# EAGLE design stylus (EAGLE 9.4.2)
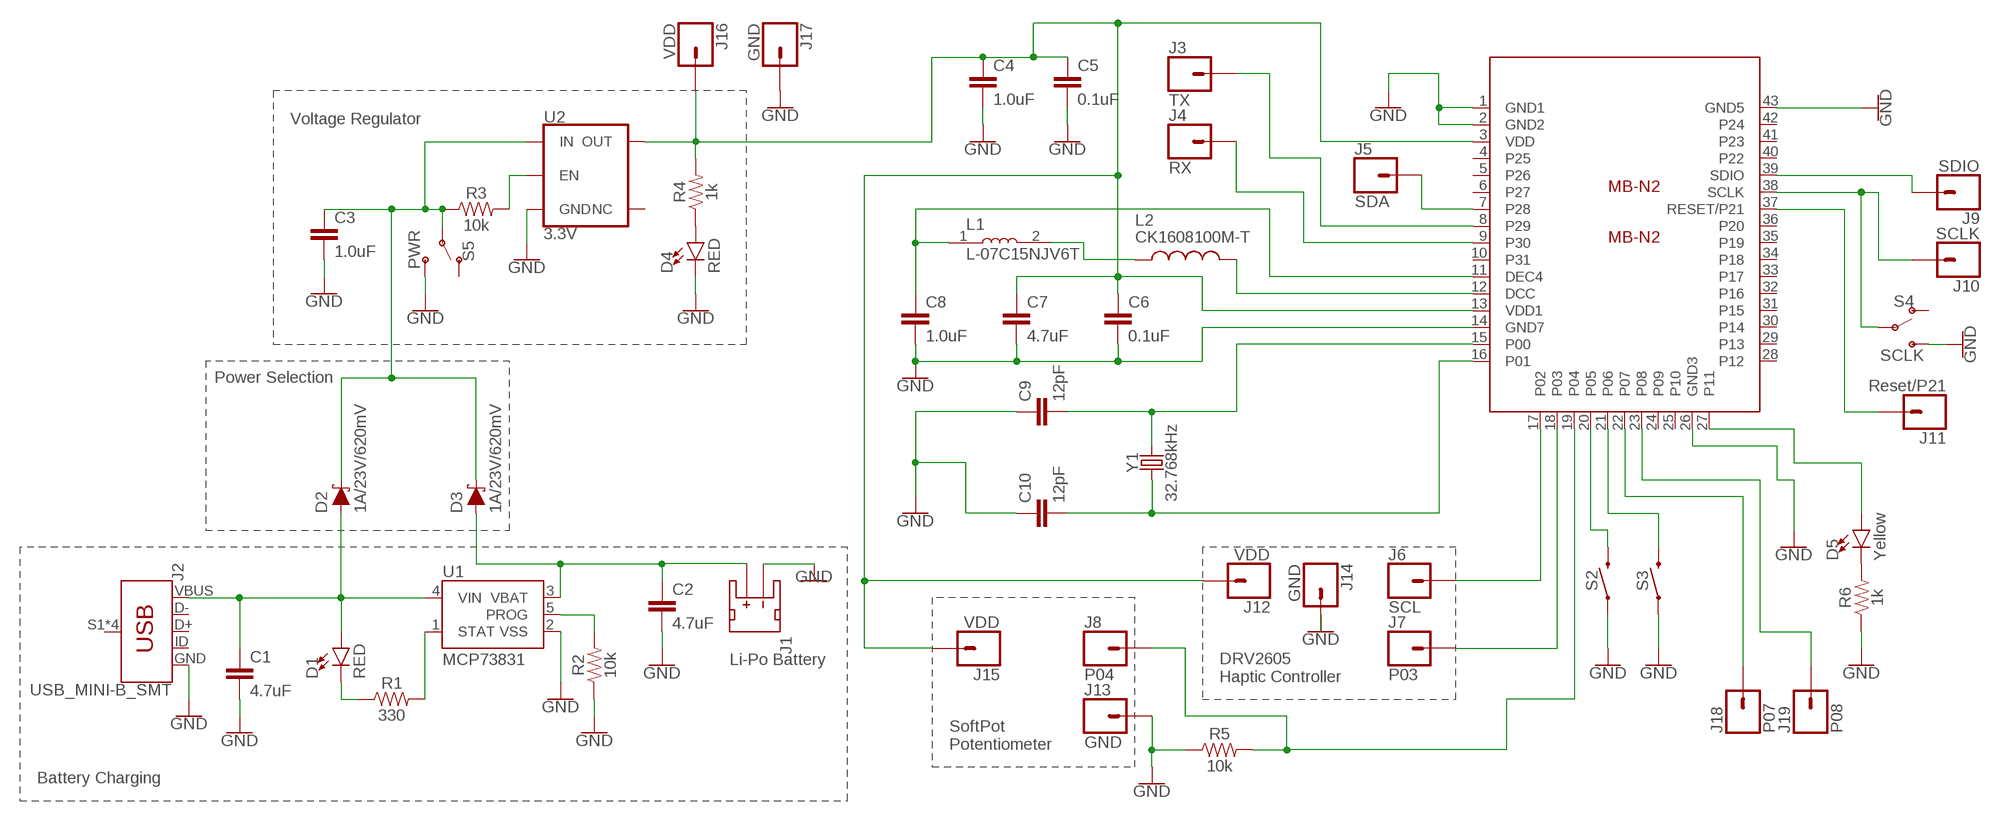
[diagram p0: schematic, sheet 1]

## Parts
C1  4.7uF  4.7UF0603  [0603]
C2  4.7uF  4.7UF0603  [0603]
C3  1.0uF  1.0UF-0603-16V-10%  [0603]
C4  1.0uF  1.0UF-0603-16V-10%  [0603]
C5  0.1uF  0.1UF-0603-25V-(+80/-20%)  [0603]
C6  0.1uF  0.1UF-0603-25V-(+80/-20%)  [0603]
C7  4.7uF  4.7UF0603  [0603]
C8  1.0uF  1.0UF-0603-16V-10%  [0603]
C9  12pF  12PF-0603-50V-5%  [0603]
C10  12pF  12PF-0603-50V-5%  [0603]
D1  RED  LED-RED1206  [LED-1206]
D2  1A/23V/620mV  DIODE-SCHOTTKY-BAT20J  [SOD-323]
D3  1A/23V/620mV  DIODE-SCHOTTKY-BAT20J  [SOD-323]
D4  RED  LED-RED0603  [LED-0603]
D5  Yellow  LED-YELLOWLILYPAD  [LED-1206]
J1  LIPO Bat  JST_2MM_MALE  [JST-2-SMD]
J2  USB_MINI-B_SMT  [USB-MINIB]
J3  TX  CONN_01  [1X01]
J4  RX  CONN_01  [1X01]
J5  SDA  CONN_01  [1X01]
J6  SCL  CONN_01  [1X01]
J7  P03  CONN_01  [1X01]
J8  P04  CONN_01  [1X01]
J9  SDIO  CONN_01  [1X01]
J10  SCLK  CONN_01  [1X01]
J11  Reset/P21  CONN_01  [1X01]
J12  VDD  CONN_01  [1X01]
J13  GND  CONN_01  [1X01]
J14  GND  CONN_01  [1X01]
J15  VDD  CONN_01  [1X01]
J16  VDD  CONN_01  [1X01]
J17  GND  CONN_01  [1X01]
J18  P07  CONN_01  [1X01]
J19  P08  CONN_01  [1X01]
L1  L-07C15NJV6T  [INDC1005X60N]
L2  CK1608100M-T  [INDC1608X95N]
MB-N2  MB-N2  [MB-N2]
R1  330  330OHM-0603-1/10W-1%  [0603]
R2  10k  10KOHM-0603-1/10W-1%  [0603]
R3  10k  10KOHM-0603-1/10W-1%  [0603]
R4  1k  1KOHM-0603-1/10W-1%  [0603]
R5  10k  10KOHM-0603-1/10W-1%  [0603]
R6  1k  1KOHM-0603-1/10W-1%  [0603]
S2  MOMENTARY-SWITCH-SPST-SMD-4.5MM  [TACTILE_SWITCH_SMD_4.5MM]
S3  MOMENTARY-SWITCH-SPST-SMD-4.5MM  [TACTILE_SWITCH_SMD_4.5MM]
S4  SCLK  SWITCH-SPDT-SMD-AYZ0202  [SWITCH_DPDT_SMD_AYZ0202]
S5  PWR  SWITCH-SPDT-SMD-RIGHT-ANGLE  [SWITCH_SPST_SMD_A]
U1  MCP73831  [SOT23-5]
U2  3.3V  V_REG_AP2112K-3.3V  [SOT23-5]
Y1  32.768kHz  CRYSTAL-32.768KHZSMD-3.2X1.5  [CRYSTAL-SMD-3.2X1.5MM]

## Nets
DCC: L2.2 MB-N2.12(DCC)
DEC4: C8.1 L1.1 MB-N2.11(DEC4)
EN: R3.2 U2.3(EN)
GND: C1.2 C2.2 C3.2 C4.2 C5.2 C6.2 C7.2 C8.2 C9.1 C10.1 D4.C J1.1(-) J2.GND J13.1 J14.1 J17.1 MB-N2.1(GND1) MB-N2.2(GND2) MB-N2.14(GND7) MB-N2.26(GND3) MB-N2.43(GND5) R2.1 R5.1 R6.1 S2.2 S2.3 S3.2 S3.3 S4.3(S) S5.3(S) U1.2(VSS) U2.2(GND)
N$2: D1.C R1.1
N$9: D4.A R4.1
N$10: L1.2 L2.1
N$13: C9.2 MB-N2.15(P00) Y1.P$2
N$15: C10.2 MB-N2.16(P01) Y1.P$1
N$20: J11.1 MB-N2.37(RESET/P21)
N$25: D5.A MB-N2.27(P11)
N$27: D5.C R6.2
P03: J7.1 MB-N2.18(P03)
P04: J8.1 MB-N2.19(P04) R5.2
P05: MB-N2.20(P05) S2.1 S2.4
P06: MB-N2.21(P06) S3.1 S3.4
P07: J18.1 MB-N2.22(P07)
P08: J19.1 MB-N2.23(P08)
PROG: R2.2 U1.5(PROG)
RX: J4.1 MB-N2.9(P30)
SCL: J6.1 MB-N2.17(P02)
SCLK: J10.1 MB-N2.38(SCLK) S4.2(P)
SDA: J5.1 MB-N2.7(P28)
SDIO: J9.1 MB-N2.39(SDIO)
STAT: R1.2 U1.1(STAT)
TX: J3.1 MB-N2.8(P29)
VBAT: C2.1 D3.A J1.2(+) U1.3(VBAT)
VDD: C4.1 C5.1 C6.1 C7.1 J12.1 J15.1 J16.1 MB-N2.3(VDD) MB-N2.13(VDD1) R4.2 U2.5(OUT)
VIN: C1.1 D1.A D2.A J2.VBUS U1.4(VIN)
VR-IN: C3.1 D2.C D3.C R3.1 S5.2(P) U2.1(IN)
Unconnected: J1.NC1(PAD1) J1.NC2(PAD2) J2.D+ J2.D- J2.ID J2.S1(SHIELD) J2.S2(SHIELD) J2.S3(SHIELD) J2.S4(SHIELD) MB-N2.4(P25) MB-N2.5(P26) MB-N2.6(P27) MB-N2.10(P31) MB-N2.24(P09) MB-N2.25(P10) MB-N2.28(P12) MB-N2.29(P13) MB-N2.30(P14) MB-N2.31(P15) MB-N2.32(P16) MB-N2.33(P17) MB-N2.34(P18) MB-N2.35(P19) MB-N2.36(P20) MB-N2.40(P22) MB-N2.41(P23) MB-N2.42(P24) S4.1(O) S5.1(O) U2.4(NC)

## Notes on the sheet
- Voltage Regulator
- Power Selection
- Li-Po Battery
- DRV2605
  Haptic Controller
- SoftPot
  Potentiometer
- Battery Charging

## Library data of the parts
C1 C2 C7 = SparkFun-Capacitors:4.7UF: 4.7µF ceramic capacitors A capacitor is a passive two-terminal electrical component used to store electrical energy temporarily in an electric field.; PROD_ID: CAP-08280
C3 C4 C8 = SparkFun-Capacitors:1.0UF: 1µF ceramic capacitors A capacitor is a passive two-terminal electrical component used to store electrical energy temporarily in an electric field.; PROD_ID: CAP-00868
C5 C6 = SparkFun-Capacitors:0.1UF: 0.1µF ceramic capacitors A capacitor is a passive two-terminal electrical component used to store electrical energy temporarily in an electric field.; PROD_ID: CAP-00810
C9 C10 = SparkFun-Capacitors:12PF: 12pF ceramic capacitors A capacitor is a passive two-terminal electrical component used to store electrical energy temporarily in an electric field.; PROD_ID: CAP-09137
D1 = SparkFun-LED:LED-RED: Red SMD LED Used in manufacturing of most products at SparkFun Packages: 0603 - SMD 0603 package [Product Link] <http://docs.avagotech.com/docs/AV02-0551EN> 0603 SMART - SMD 0603 SMART package ( more efficient and expensive)[Product Link] <http://www.osram-os.com/Graphics/XPic2/00077099_0.pdf> 1206 - SMD1206 package [Product Link] <https://www.sparkfun.com/datasheets/DevTools/LilyPad/Q150OVS4.pdff> SparkFun Products: Pro Mini 328 -5V <https://www.sparkfun.com/products/821> RedBoard <https://www.sparkfun.com/products/12757> IOIO-OTG <https://www.sparkfun.com/products/13613>; PROD_ID: DIO-09912
D2 D3 = SparkFun-DiscreteSemi:DIODE-SCHOTTKY: Schottky diode A Schottky diode is a semiconductor diode which has a low forward voltage drop and a very fast switching action.; PROD_ID: DIO-11623
D4 = SparkFun-LED:LED-RED: Red SMD LED Used in manufacturing of most products at SparkFun Packages: 0603 - SMD 0603 package [Product Link] <http://docs.avagotech.com/docs/AV02-0551EN> 0603 SMART - SMD 0603 SMART package ( more efficient and expensive)[Product Link] <http://www.osram-os.com/Graphics/XPic2/00077099_0.pdf> 1206 - SMD1206 package [Product Link] <https://www.sparkfun.com/datasheets/DevTools/LilyPad/Q150OVS4.pdff> SparkFun Products: Pro Mini 328 -5V <https://www.sparkfun.com/products/821> RedBoard <https://www.sparkfun.com/products/12757> IOIO-OTG <https://www.sparkfun.com/products/13613>; PROD_ID: DIO-00819
D5 = SparkFun-LED:LED-YELLOW: Yellow SMD LED Used in manufacturing several products at SparkFun. Packages: 0603 - SMD 0603 package[Product Link] <http://www.kingbrightusa.com/product.asp?catalog_name=LED&product_id=APT1608SYCK> 0603 -SMART - SMART SMD 0603 package (more efficient/more expensive) [Product Link] <http://www.osram-os.com/osram_os/en/products/product-catalog/led-light-emitting-diodes/smartled-0603/ly-l29k/index.jsp> LilyPad - SMD1206 package[Product Datasheet] <https://www.sparkfun.com/datasheets/DevTools/LilyPad/Q150YUS4.pdf> SparkFun Products: Blynk Board <https://www.sparkfun.com/products/13794> IOIO-OTG <https://www.sparkfun.com/products/13613> XBee Explorer Serial <https://www.sparkfun.com/products/13225>; PROD_ID: DIO-09909
J1 = SparkFun-Connectors:JST_2MM_MALE: JST 2MM MALE RA CONNECTOR Two pin, compact surface mount connector. Commonly used as a battery input connection point. We really like the solid locking feeling and high current rating on these small connectors. We use these all the time as battery connectors. Mates to single-cell LiPo batteries. Here is the connector we sell at SparkFun: JST Right Angle Connector - White <https://www.sparkfun.com/products/8612> (PRT-08612) Datasheet <http://www.sparkfun.com/datasheets/Prototyping/Connectors/JST-Horizontal.pdf> It was used on these SparkFun products: SparkFun MOSFET Power Controller <https://www.sparkfun.com/products/11214> (PRT-11214) SparkFun Battery Babysitter - LiPo Battery Manager <https://www.sparkfun.com/products/13777> (PRT-13777) And many, many others that required a lipo battery connection.; PROD_ID: CONN-11443; SF_ID: PRT-08612
J2 = SparkFun-Connectors:USB_MINI-B: USB type Mini-B Connector Breaks out 5th pin, and includes shield pins if needed. SparkFun Products: SparkFun FTDI Basic Breakout <https://www.sparkfun.com/products/9716> SparkFun XBee Explorer USB <https://www.sparkfun.com/products/11812> SparkFun Redboard <https://www.sparkfun.com/products/12757>; PROD_ID: CONN-08193; SF_ID: PRT-00587
J3-J19 = SparkFun-Connectors:CONN_01: Single connection point. Often used as Generic Header-pin footprint for 0.1 inch spaced/style header connections On any of the 0.1 inch spaced packages, you can populate with these: Break Away Headers - Straight <https://www.sparkfun.com/products/116> (PRT-00116) Break Away Male Headers - Right Angle <https://www.sparkfun.com/products/553> (PRT-00553) Female Headers <https://www.sparkfun.com/products/115> (PRT-00115) Break Away Headers - Machine Pin <https://www.sparkfun.com/products/117> (PRT-00117) Break Away Female Headers - Swiss Machine Pin <https://www.sparkfun.com/products/743> (PRT-00743) This device is also useful as a general connection point to wire up your design to another part of your project. Our various solder wires solder well into these plated through hole pads. Hook-Up Wire - Assortment (Stranded, 22 AWG) <https://www.sparkfun.com/products/11375> (PRT-11375) Hook-Up Wire - Assortment (Solid Core, 22 AWG) <https://www.sparkfun.com/products/11367> (PRT-11367) View the entire wire category on our website here <https://www.sparkfun.com/categories/141> Special notes: SMTSO-256-ET is a "flush mount" nut for a 4-40 screw. We mostly use this on specialty testbeds; it is a nice way to connect hardware to your PCB at an adjustable hieght. Also note, the SNAP packages are for using a snappable style connector. We sell a baggie of snaps and they are also used on two LilyPad designs: Snap Assortment - 30 pack (male and female) <https://www.sparkfun.com/products/11347> (DEV-11347) LilyPad Arduino SimpleSnap <https://www.sparkfun.com/products/10941> (DEV-10941) LilyPad SimpleSnap Protoboard <https://www.sparkfun.com/products/10940> (DEV-10940)
L1 = L-07C15NJV6T:L-07C15NJV6T: Inductor RF Chip Multi-Layer 15nH 5% 100MHz 8Q-Factor Ceramic 250mA 600mOhm DCR 0402 T/R; DESCRIPTION: Inductor RF Chip Multi-Layer 15nH 5% 100MHz 8Q-Factor Ceramic 250mA 600mOhm DCR 0402 T/R; DIGI-KEY_PART_NUMBER: 712-1408-1-ND; DIGI-KEY_PURCHASE_URL: https://www.digikey.com/product-detail/en/johanson-technology-inc/L-07C15NJV6T/712-1408-1-ND/1840086?utm_source=snapeda&utm_medium=aggregator&utm_campaign=symbol; MF: Johanson Technology; MP: L-07C15NJV6T; PACKAGE: 0402 Johanson
L2 = CK1608100M-T:CK1608100M-T: INDUCTOR, 10UH, 50mA, 20%, 17MHZ, SMD; DESCRIPTION: Inductor Chip Shielded Multi-Layer 10uH 20% 2MHz 20Q-Factor Ferrite 50mA 1.105Ohm DCR 0603 T/R; DIGI-KEY_PART_NUMBER: 587-1684-1-ND; DIGI-KEY_PURCHASE_URL: https://www.digikey.com/product-detail/en/taiyo-yuden/CK1608100M-T/587-1684-1-ND/1007998?utm_source=snapeda&utm_medium=aggregator&utm_campaign=symbol; MF: Taiyo Yuden; MP: CK1608100M-T; PACKAGE: 1608 Taiyo Yuden
MB-N2 = MB-N2:MB-N2
R1 = SparkFun-Resistors:330OHM: 330Ω resistor A resistor is a passive two-terminal electrical component that implements electrical resistance as a circuit element. Resistors act to reduce current flow, and, at the same time, act to lower voltage levels within circuits. - Wikipedia; PROD_ID: RES-00818
R2 R3 R5 = SparkFun-Resistors:10KOHM: 10kΩ resistor A resistor is a passive two-terminal electrical component that implements electrical resistance as a circuit element. Resistors act to reduce current flow, and, at the same time, act to lower voltage levels within circuits. - Wikipedia; PROD_ID: RES-00824
R4 R6 = SparkFun-Resistors:1KOHM: 1kΩ resistor A resistor is a passive two-terminal electrical component that implements electrical resistance as a circuit element. Resistors act to reduce current flow, and, at the same time, act to lower voltage levels within circuits. - Wikipedia; PROD_ID: RES-07856
S2 S3 = SparkFun-Switches:MOMENTARY-SWITCH-SPST: Momentary Switch (Pushbutton) - SPST Normally-open (NO) SPST momentary switches (buttons, pushbuttons). Variants PTH-12MM - 12mm square, through-hole Momentary Pushbutton Switch - 12mm Square <https://www.sparkfun.com/products/9190> (COM-09190) PTH-6.0MM, PTH-6.0MM-KIT - 6.0mm square, through-hole Mini Pushbutton Switch <https://www.sparkfun.com/products/97> (COM-00097) KIT package intended for soldering kit's - only one side of pads' copper is exposed. PTH-RIGHT-ANGLE-KIT - Right-angle, through-hole Right Angle Tactile Button <https://www.sparkfun.com/products/10791> - Used on SparkFun BigTime Watch Kit <https://www.sparkfun.com/products/11734> SMD-12MM - 12mm square, surface-mount Tactile Button - SMD (12mm) <https://www.sparkfun.com/products/12993> (COM-12993) Used on SparkFun PicoBoard <https://www.sparkfun.com/products/11888> SMD-4.5MM - 4.5mm Square Trackball Switch Used on SparkFun Blackberry Trackballer Breakout <https://www.sparkfun.com/products/13169> SMD-4.6MMX2.8MM - 4.60mm x 2.80mm, surface mount Used on SparkFun SAMD21 Mini Breakout <https://www.sparkfun.com/products/13664> SMD-5.2MM, SMD-5.2-REDUNDANT - 5.2mm square, surface-mount Mini Pushbutton Switch - SMD <https://www.sparkfun.com/products/8720> (COM-08720) Used on Arduino Pro Mini <https://www.sparkfun.com/products/11114> REDUNDANT package connects both switch circuits together SMD-6.0X3.5MM - 6.0 x 3.5mm, surface mount Momentary Reset Switch SMD <https://www.sparkfun.com/products/8229> (COM-08229) SMD-6.2MM-TALL - 6.2mm square, surface mount Tactile Button - SMD (6mm) <https://www.sparkfun.com/products/12992> Used on SparkFun Digital Sandbox <https://www.sparkfun.com/products/12651> SMD-RIGHT-ANGLE - Right-angle, surface mount Used on SparkFun Block for Intel® Edison - Arduino <https://www.sparkfun.com/products/13036>; PROD_ID: SWCH-09213
S4 = SparkFun-Switches:SWITCH-SPDT: Single Pole, Double Throw (SPDT) Switch Single-pole, double-throw (SPDT) switch. Variant Overview SMD-AYZ0202 Surface Mount DPDT Switch <https://www.sparkfun.com/products/597> (COM-00597) Used on e.g. LilyPad Arduino USB - ATmega32U4 Board <https://www.sparkfun.com/products/12049> PTH-11.6X4.0MM SPDT Mini Power Switch <https://www.sparkfun.com/products/102> (COM-00102) Used on e.g. SparkFun Simon Says - Through-Hole Soldering Kit <https://www.sparkfun.com/products/10547> (KIT-10547) PTH-11.6X4.0MM-KIT KIT version of SPDT Mini Power Switch - Simplifies soldering by removing tStop of switch pins - only one side can be soldered. PTH-11.6X4.0MM-LOCK LOCK version of SPDT Mini Power Switch - Offset pins hold switch in place for easier soldering. SMD-RIGHT-ANGLE Surface Mount Right Angle Switch <https://www.sparkfun.com/products/10860> (COM-10860) Used on e.g. SparkFun ESP8266 Thing <https://www.sparkfun.com/products/13231>; PROD_ID: SWCH-08179; SF_ID: COM-00597
S5 = SparkFun-Switches:SWITCH-SPDT: Single Pole, Double Throw (SPDT) Switch Single-pole, double-throw (SPDT) switch. Variant Overview SMD-AYZ0202 Surface Mount DPDT Switch <https://www.sparkfun.com/products/597> (COM-00597) Used on e.g. LilyPad Arduino USB - ATmega32U4 Board <https://www.sparkfun.com/products/12049> PTH-11.6X4.0MM SPDT Mini Power Switch <https://www.sparkfun.com/products/102> (COM-00102) Used on e.g. SparkFun Simon Says - Through-Hole Soldering Kit <https://www.sparkfun.com/products/10547> (KIT-10547) PTH-11.6X4.0MM-KIT KIT version of SPDT Mini Power Switch - Simplifies soldering by removing tStop of switch pins - only one side can be soldered. PTH-11.6X4.0MM-LOCK LOCK version of SPDT Mini Power Switch - Offset pins hold switch in place for easier soldering. SMD-RIGHT-ANGLE Surface Mount Right Angle Switch <https://www.sparkfun.com/products/10860> (COM-10860) Used on e.g. SparkFun ESP8266 Thing <https://www.sparkfun.com/products/13231>; PROD_ID: SWCH-10651; SF_SKU: COM-10860
U1 = SparkFun-IC-Power:MCP73831: MCP73831T Li-Ion, Li-Pol Controller Miniature single cell, fully integrated Li-Ion, Li-polymer charge management controller Datasheet <http://ww1.microchip.com/downloads/en/DeviceDoc/20001984g.pdf> SparkFun Products: SparkFun ESP32 Thing <https://www.sparkfun.com/products/13907> SparkFun 9DoF Razor IMU M0 <https://www.sparkfun.com/products/14001>; PROD_ID: IC-09995
U2 = SparkFun-IC-Power:V_REG_AP2112: AP2112 - 600mA CMOS LDO Regulator w/ Enable The AP2112 is CMOS process low dropout linear regulator with enable function, the regulator delivers a guaranteed 600mA (min.) continuous load current. Features Output Voltage Accuracy: ±1.5% Output Current: 600mA (Min.) Foldback Short Current Protection: 50mA Enable Function to Turn ON/OFF VOUT Low Dropout Voltage (3.3V): 250mV (Typ.) @IOUT=600mA Excellent Load Regulation: 0.2%/A (Typ.) Excellent Line Regulation: 0.02%/V (Typ.) Low Quiescent Current: 55μA (Typ.) Low Standby Current: 0.01μA (Typ.) Low Output Noise: 50μVRMS PSRR: 100Hz -65dB, 1kHz -65dB OTSD Protection Stable with 1.0μF Flexible Cap: Ceramic, Tantalum and Aluminum Electrolytic Operation Temperature Range: -40°C to 85°C ESD: MM 400V, HBM 4000V; PROD_ID: VREG-12457
Y1 = SparkFun-Clocks:CRYSTAL-32.768KHZ: 32.768kHz Crystal Frequency: 32.768kHz Frequency Stability: ±20ppm Load Capacitance: 12.5pF (PTH-2X6 & SMD-3.2X1.5), 6pF (SMD-2X6) SparkFun Products: SparkFun BigTime Watch Kit <https://www.sparkfun.com/products/11734> SparkFun nRF52832 Breakout <https://www.sparkfun.com/products/13990> SparkFun Real Time Clock Module <https://www.sparkfun.com/products/12708>; PROD_ID: XTAL-13062

## Board
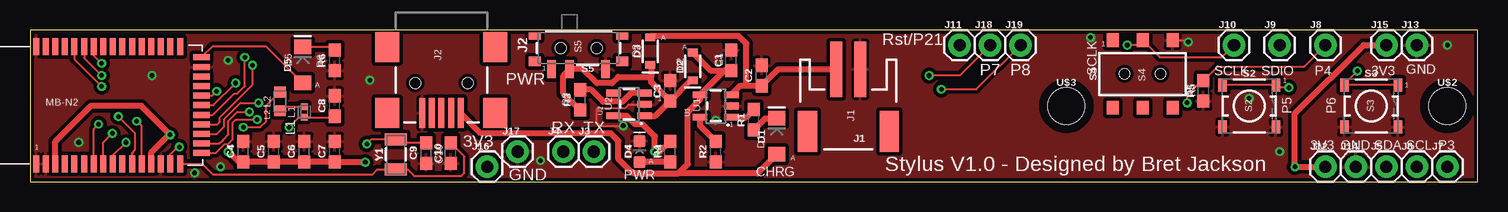
[diagram p1: board, top side]
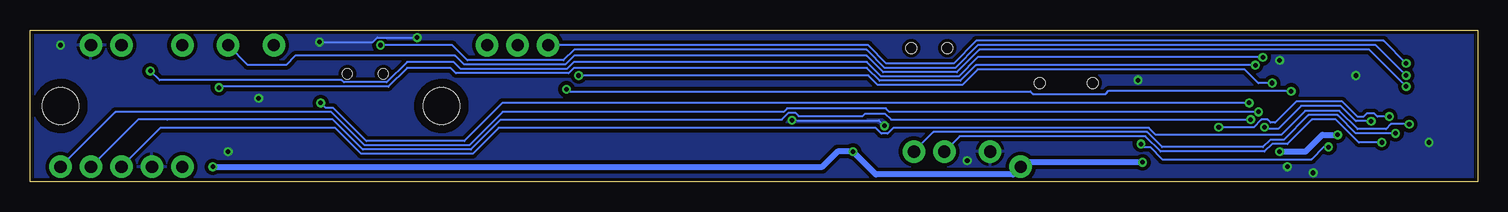
[diagram p2: board, bottom side, seen from below]

Size 120.65 x 12.7 mm. Coordinates in mm from the lower left corner, seen from the top.
Outline: 0,0 120.63,0 120.65,12.7 0,12.7 0,0
Copper layers (1*16): Top 0.035mm / dielectric 1.5mm / Bottom 0.035mm
Design rules "SparkFun-2-layer-TIGHT": minimum track width 7mil, minimum drill 15mil, track to track 7mil, track to pad 7mil, pad to pad 7mil, via to via 7mil, smd to smd 7mil, copper to edge 7mil, drill to drill 7mil, minimum pad ring 7mil, minimum via ring 7mil, stop-mask expansion 4mil, vias tented up to drill 25mil, thermal gap 10mil

### Footprints (pad centres in the part's own frame; a part is rotated, then mirrored left to right if it is on the bottom)
0603 = smd 1.1 x 1: 1 -0.85,0; 2 0.85,0
LED-1206 = smd 1.2 x 1.4: A -1.5,0; C 1.5,0
SOD-323 = smd 0.63 x 0.83: A 1.15,0; C -1.15,0
LED-0603 = smd 1 x 1: A -0.877,0; C 0.877,0
JST-2-SMD = smd 1 x 4.6: 1 -1,-3.7; 2 1,-3.7 | smd 1.6 x 3.4: NC1 -3.4,1.5; NC2 3.4,1.5
USB-MINIB = smd 2.5 x 0.5: D+ 2.5,0; D- 2.5,0.8; GND 2.5,-1.6; ID 2.5,-0.8; VBUS 2.5,1.6 | smd 2.5 x 2: S1 -3,4.5; S2 2.5,4.5; S3 -3,-4.5; S4 2.5,-4.5 | hole 0.9: 0,2.2; 0,-2.2
1X01 = drill 1.016 pad 1.88: 1 0,0
INDC1005X60N = smd 0.54 x 0.63: 1 -0.445,0; 2 0.445,0
INDC1608X95N = smd 0.9 x 0.97: 1 -0.785,0; 2 0.785,0
MB-N2 = smd 1.4 x 0.5: 1 -0.649,13.085; 2 -0.649,12.285; 3 -0.649,11.485; 4 -0.649,10.685; 5 -0.649,9.885; 6 -0.649,9.085; 7 -0.649,8.285; 8 -0.649,7.485; 9 -0.649,6.685; 10 -0.649,5.885; 11 -0.649,5.085; 12 -0.649,4.285; 13 -0.649,3.485; 14 -0.649,2.685; 15 -0.649,1.885; 16 -0.649,1.085; 28 9.151,1.085; 29 9.151,1.885; 30 9.151,2.685; 31 9.151,3.485; 32 9.151,4.285; 33 9.151,5.085; 34 9.151,5.885; 35 9.151,6.685; 36 9.151,7.485; 37 9.151,8.285; 38 9.151,9.085; 39 9.151,9.885; 40 9.151,10.685; 41 9.151,11.485; 42 9.151,12.285; 43 9.151,13.085 | smd 0.5 x 1.4: 17 0.251,-0.7; 18 1.051,-0.7; 19 1.851,-0.7; 20 2.651,-0.7; 21 3.451,-0.7; 22 4.251,-0.7; 23 5.051,-0.7; 24 5.851,-0.7; 25 6.651,-0.7; 26 7.451,-0.7; 27 8.251,-0.7
TACTILE_SWITCH_SMD_4.5MM = smd 0.7 x 1.1: 1 2.225,1.75; 2 2.225,-1.75; 3 -2.225,-1.75; 4 -2.225,1.75
SWITCH_DPDT_SMD_AYZ0202 = smd 1 x 1.15: 1 -2.5,2.825; 2 0,2.825; 3 2.5,2.825; 4 -2.5,-2.825; 5 0,-2.825; 6 2.5,-2.825 | hole 0.85: 1.5,0; -1.5,0
SWITCH_SPST_SMD_A = smd 0.7 x 1.5: 1 -2.25,-1.75; 2 -0.75,-1.75; 3 2.25,-1.75 | smd 1 x 0.6: GND1 -3.65,1; GND3 3.65,1 | smd 1 x 0.8: GND2 -3.65,-1.1; GND4 3.65,-1.1 | hole 0.9: -1.5,0; 1.5,0
SOT23-5 = smd 0.55 x 1.2: 1 -0.95,-1.3; 2 0,-1.3; 3 0.95,-1.3; 4 0.95,1.3; 5 -0.95,1.3
STAND-OFF-TIGHT = hole 3.048: 0,0
CRYSTAL-SMD-3.2X1.5MM = smd 1 x 1.8: P$1 -1.25,0; P$2 1.25,0

### Placement (x,y rotation side)
C1  58.42,10.16 90 top
C2  60.96,8.89 90 top
C3  53.34,7.62 90 top
C4  17.78,2.54 90 top
C5  20.32,2.54 90 top
C6  22.86,2.54 90 top
C7  25.4,2.54 90 top
C8  25.4,6.35 90 top
C9  33.02,2.41 90 top
C10  35.05,2.41 90 top
D1  62.23,3.81 90 top
D2  55.24,9.65 90 top
D3  51.69,10.92 90 top
D4  50.8,2.54 90 top
D5  22.73,9.78 90 top
J1  68.2,5.71 180 top
J2  34.29,8.26 270 top
J3  46.99,2.54 0 top
J4  44.45,2.54 0 top
J5  113.03,1.27 0 top
J6  115.57,1.27 0 top
J7  118.11,1.27 0 top
J8  107.95,11.43 0 top
J9  104.14,11.43 0 top
J10  100.33,11.43 0 top
J11  77.47,11.43 0 top
J12  107.95,1.27 0 top
J13  115.57,11.43 0 top
J14  110.49,1.27 0 top
J15  113.03,11.43 0 top
J16  38.1,1.27 0 top
J17  40.64,2.54 0 top
J18  80.01,11.43 0 top
J19  82.55,11.43 0 top
L1  22.86,5.84 90 top
L2  20.83,6.73 90 top
MB-N2  13.59,2.16 90 top
R1  60.33,5.21 90 top
R2  57.15,2.54 90 top
R3  45.85,6.86 90 top
R4  53.34,2.54 90 top
R5  97.79,7.62 90 top
R6  25.4,10.16 90 top
S2  101.6,6.35 0 top
S3  111.76,6.35 0 top
S4  92.71,9.02 0 top
S5  45.72,11.18 0 top
U1  57.15,6.35 90 top
U2  49.91,6.48 90 top
U$2  [STAND-OFF-TIGHT]  118.11,6.35 0 top
U$3  [STAND-OFF-TIGHT]  86.36,6.35 0 top
Y1  30.48,2.29 90 top

### Tracks (layer width: path | path; a pad name or v marks a point on that pad's centre or on a via)
DCC  (via drill 0.38)
  Top 0.178: MB-N2.12 9.3,4.67 v8.89,5.08 | v17.78,4.57 19.05,4.57 19.06,4.58 19.2,4.58 19.68,5.07 19.68,6.37 L2.2
  Bottom 0.178: v8.89,5.08 10.16,5.08 11.43,6.35 14.73,6.35 16.64,4.45 17.65,4.45 v17.78,4.57
DEC4  (via drill 0.38)
  Top 0.178: MB-N2.11 8.5,2.41 8.76,2.67 8.76,4.06 v7.37,5.46 | v21.59,4.57 22.41,5.4 L1.1 25.3,5.4 C8.1
  Bottom 0.178: v7.37,5.46 8.37,5.46 8.63,5.71 9.27,5.71 9.55,5.44 10.01,5.44 11.28,6.71 15.14,6.71 16.89,4.95 17.26,4.95 17.52,5.21 18.04,5.21 18.68,4.57 v21.59,4.57
EN
  Top 0.508: U2.3 50.1,7.43 49.39,6.72 47.76,6.72 46.77,7.71 R3.2
GND  (via drill 0.38)
  Top 0.178: S4.3 96.36,11.84 v96.52,11.68 | v49.44,4.68 47.51,4.68 47.24,4.95 47.24,6.1 47.35,6.2 49.6,6.2 49.88,6.48 U2.2
  Bottom 0.178: v96.52,11.68 92.08,11.68 91.7,12.06 v88.39,12.06 | v57.15,5.16 49.91,5.16 v49.44,4.68
  other vias: 118.11,11.43 104.14,2.54 101.6,6.99 4.06,3.3 10.16,8.89 16.51,10.16 42.55,1.78 28.32,8.51 15.88,1.27 13.72,0.76
  pour Top (isolate 0.305): 0,0 120.65,0 120.65,12.7 0,12.7
  pour Bottom (isolate 0.305): 0,0 120.65,0 120.65,12.7 0,12.7
N$2
  Top 0.508: R1.1 61.28,5.31 D1.C
N$9
  Top 0.508: R4.1 53.31,1.66 D4.A
N$10
  Top 0.178: L2.1 21.17,6.29 L1.2
N$13  (via drill 0.38)
  Top 0.178: MB-N2.15 11.7,2.31 12.32,2.92 v12.45,2.92 | v28.07,3.17 28.43,3.54 Y1.P$2 30.75,3.26 C9.2
  Bottom 0.178: v12.45,2.92 12.83,2.92 13.84,1.91 26.3,1.91 27.31,2.92 27.81,2.92 v28.07,3.17
N$15
  Top 0.178: MB-N2.16 14.37,1.51 15.24,0.64 28.55,0.64 28.96,1.04 Y1.P$1 31.48,1.04 32,0.51 35.94,0.51 36.2,0.76 36.2,2.12 C10.2
N$20  (via drill 0.38)
  Top 0.178: v5.97,9.91 5.3,10.57 MB-N2.37
  Bottom 0.178: v5.97,9.91 7.85,11.79 41.81,11.79 43.69,9.91 49.28,9.91 50.8,11.43 J11.1
N$25
  Top 0.178: MB-N2.27 15.23,11.35 19.66,11.35 D5.A
N$27
  Top 0.178: R6.2 25.13,11.28 D5.C
P03  (via drill 0.38)
  Top 0.178: v18.27,5.85 17.29,5.85 16.54,5.1 16.54,3.96 16.1,3.53 15.78,3.21 MB-N2.18
  Bottom 0.178: J7.1 113.54,5.84 95.53,5.84 92.76,3.07 84.05,3.07 81.27,5.85 57.86,5.85 57.56,6.15 49.33,6.15 49.04,5.85 v18.27,5.85
P04  (via drill 0.38)
  Top 0.178: J8.1 106.17,9.65 98.97,9.65 R5.2 97.66,8.47 96.42,7.24 v96.42,6.6 | MB-N2.19 15.57,4.01 16.18,4.62 16.18,5.25 17.54,6.6 v19.05,6.6
  Bottom 0.178: v19.05,6.6 81.28,6.6 84.45,3.43 92.61,3.43 95.38,6.2 96.02,6.2 v96.42,6.6
P05  (via drill 0.38)
  Top 0.178: S2.4 S2.1 104.05,7.87 v104.9,7.87 | MB-N2.20 15.61,4.81 15.82,5.03 15.82,5.41 18.54,8.12 v18.54,9.76
  Bottom 0.178: v18.54,9.76 41.83,9.76 43.12,8.46 49.84,8.46 50.91,9.53 75.33,9.53 75.76,9.09 85.17,9.09 85.6,9.53 89.22,9.53 90.78,7.97 104.81,7.97 v104.9,7.87
P06  (via drill 0.38)
  Top 0.178: S3.1 S3.4 109.53,8.19 v110.62,9.27 | MB-N2.21 15.24,5.61 17,7.37 17.28,7.37 17.91,8 v17.91,10.41
  Bottom 0.178: v17.91,10.41 41.67,10.41 43.27,8.81 49.7,8.81 50.92,10.03 75.32,10.03 75.91,9.45 84.76,9.45 85.34,10.03 89.22,10.03 90.92,8.32 94.5,8.32 94.68,8.51 109.86,8.51 v110.62,9.27
P07  (via drill 0.38)
  Top 0.178: MB-N2.22 15.29,6.41 v17.14,8.26 | J18.1 77.47,8.89 v74.93,8.89
  Bottom 0.178: v17.14,8.26 18.29,8.26 19.43,9.4 41.68,9.4 42.98,8.1 49.99,8.1 50.78,8.89 v74.93,8.89
P08  (via drill 0.38)
  Top 0.178: v75.95,7.75 78.87,7.75 J19.1 | MB-N2.23 15.19,7.21 v15.55,7.57
  Bottom 0.178: v75.95,7.75 75.77,7.57 37.29,7.57 37.08,7.37 30.99,7.37 30.73,7.62 15.6,7.62 v15.55,7.57
PROG
  Top 0.508: R2.2 55.85,4.69 U1.5
RX  (via drill 0.38)
  Top 0.178: MB-N2.9 6.9,2.21 v8,3.3
  Bottom 0.178: v8,3.3 9.91,3.3 11.82,5.22 13.83,5.22 15.88,3.17 17.14,3.17 17.78,2.54 26.43,2.54 27.7,3.81 43.18,3.81 J4.1
SCL  (via drill 0.38)
  Top 0.178: MB-N2.17 15.48,2.41 16.25,3.17 16.51,3.17 16.89,3.56 16.89,4.95 17.15,5.22 v18.93,5.22
  Bottom 0.178: v18.93,5.22 18.94,5.21 48.9,5.21 49.4,5.71 51.06,5.71 51.27,5.51 56.61,5.51 56.89,5.79 57.41,5.79 57.99,5.21 81.41,5.21 83.9,2.72 92.91,2.72 95.41,5.22 109.21,5.22 109.22,5.21 111.63,5.21 J6.1
SCLK  (via drill 0.38)
  Top 0.178: MB-N2.38 4.5,10.36 v5.97,8.89 | J10.1 99.31,10.41 94.14,10.41 S4.2 92.3,11.43 v91.44,11.43
  Bottom 0.178: v5.97,8.89 8.51,11.43 41.66,11.43 43.57,9.53 49.4,9.53 50.93,11.05 75.31,11.05 76.2,10.16 84.2,10.16 85.47,11.43 v91.44,11.43
SDA  (via drill 0.38)
  Top 0.178: MB-N2.7 5.3,4.42 v5.71,4.83
  Bottom 0.178: v5.71,4.83 7.24,4.83 7.64,4.42 10.02,4.42 11.53,5.93 14.39,5.93 16.38,3.94 26.82,3.94 27.41,4.52 48.7,4.52 49.17,4.05 49.7,4.05 50.17,4.52 81.59,4.52 83.75,2.36 93.06,2.36 95.22,4.52 109.78,4.52 J5.1
SDIO  (via drill 0.38)
  Top 0.178: MB-N2.39 3.7,10.24 v5.97,7.98
  Bottom 0.178: v5.97,7.98 9.04,11.05 41.54,11.05 43.42,9.17 49.55,9.17 50.92,10.54 75.32,10.54 76.05,9.8 84.48,9.8 85.22,10.54 98.55,10.54 99.31,9.78 102.49,9.78 J9.1
STAT
  Top 0.508: U1.1 59.67,5.4 R1.2
TX  (via drill 0.38)
  Top 0.178: v6.86,4.06 6.48,3.68 6.1,3.31 MB-N2.8
  Bottom 0.178: v6.86,4.06 10.16,4.06 11.68,5.58 14.11,5.58 16.15,3.53 17.29,3.53 17.9,2.92 26.31,2.92 27.55,4.17 45.36,4.17 J3.1
VBAT
  Top 0.508: U1.3 59.19,8.04 59.69,8.04 | 59.69,8.04 C2.1 62.34,9.41 J1.2 | D3.A 51.81,12.19 59.05,12.19 59.69,11.56 59.69,8.04
VDD  (via drill 0.38)
  Top 0.508: MB-N2.13 10.1,2.48 11.56,3.94 v11.68,3.94 9.27,6.35 5.08,6.35 2.1,3.37 MB-N2.3 | v16.51,2.54 17.36,1.69 C4.1 C5.1 C6.1 C7.1 27.9,1.69 v27.94,1.65 | R4.2 52.49,2.54 v52.07,2.54 52.07,3.81 51.06,4.82 50.43,4.82 49.73,5.53 U2.5 | J12.1 v105.41,1.27 105.41,5.71 111.12,11.43 J15.1
  Bottom 0.508: v105.41,1.27 54.61,1.27 53.34,2.54 v52.07,2.54 50.16,0.64 38.73,0.64 J16.1 37.72,1.65 v27.94,1.65 | v11.68,3.94 12.95,3.94 14.35,2.54 v16.51,2.54
VIN
  Top 0.508: 54.02,0.71 50.8,0.71 50.78,0.73 50.21,0.73 49.02,1.92 49.02,3.43 48.39,4.06 37.58,4.06 J2.VBUS | 54.02,0.71 54.58,1.27 54.61,1.27 54.82,1.48 54.82,5.85 55.85,6.89 U1.4 57.86,9.31 | D1.A 60.63,0.71 54.02,0.71 | C1.1 57.86,9.31 | D2.A 56.74,9.31 57.86,9.31
VR-IN
  Top 0.508: D3.C 51.75,9.71 51.75,8.76 | 51.75,8.76 49.02,8.76 48.5,8.24 47.26,8.24 46.07,9.43 S5.2 44.45,8.91 44.45,7.41 R3.1 | C3.1 55.07,8.5 D2.C | U2.1 52.1,5.53 C3.1 | 51.75,8.76 51.75,8.36 51.98,8.13 51.99,8.13 52.24,7.88 52.24,7.87 C3.1

### Text on the board
tPlace: A | S5 | A | Rst/P21 | 1 | D5 | R6 | J2 | D3 | C1 | 1 | D2 | P7 | P8 | SCLK | SCLK | SDIO | P4 | 3V3 | GND | A | PWR | C2 | S4 | 1 | 1 | 1 | C3 | R5 | MB-N2 | L2 | C8 | R3 | U2 | U1 | S2 | P5 | P6 | S3 | L1 | 1 | R1 | J1 | RX | TX | 1 | 3V3 | D1 | 3V3 | GND | SDA | SCL | P3 | C4 | C5 | C6 | C7 | Y1 | C9 | C10 | D4 | A | R4 | R2 | A | PWR | CHRG | Stylus V1.0 - Designed by Bret Jackson | GND